# EAGLE design NEW (EAGLE 9.6.2)
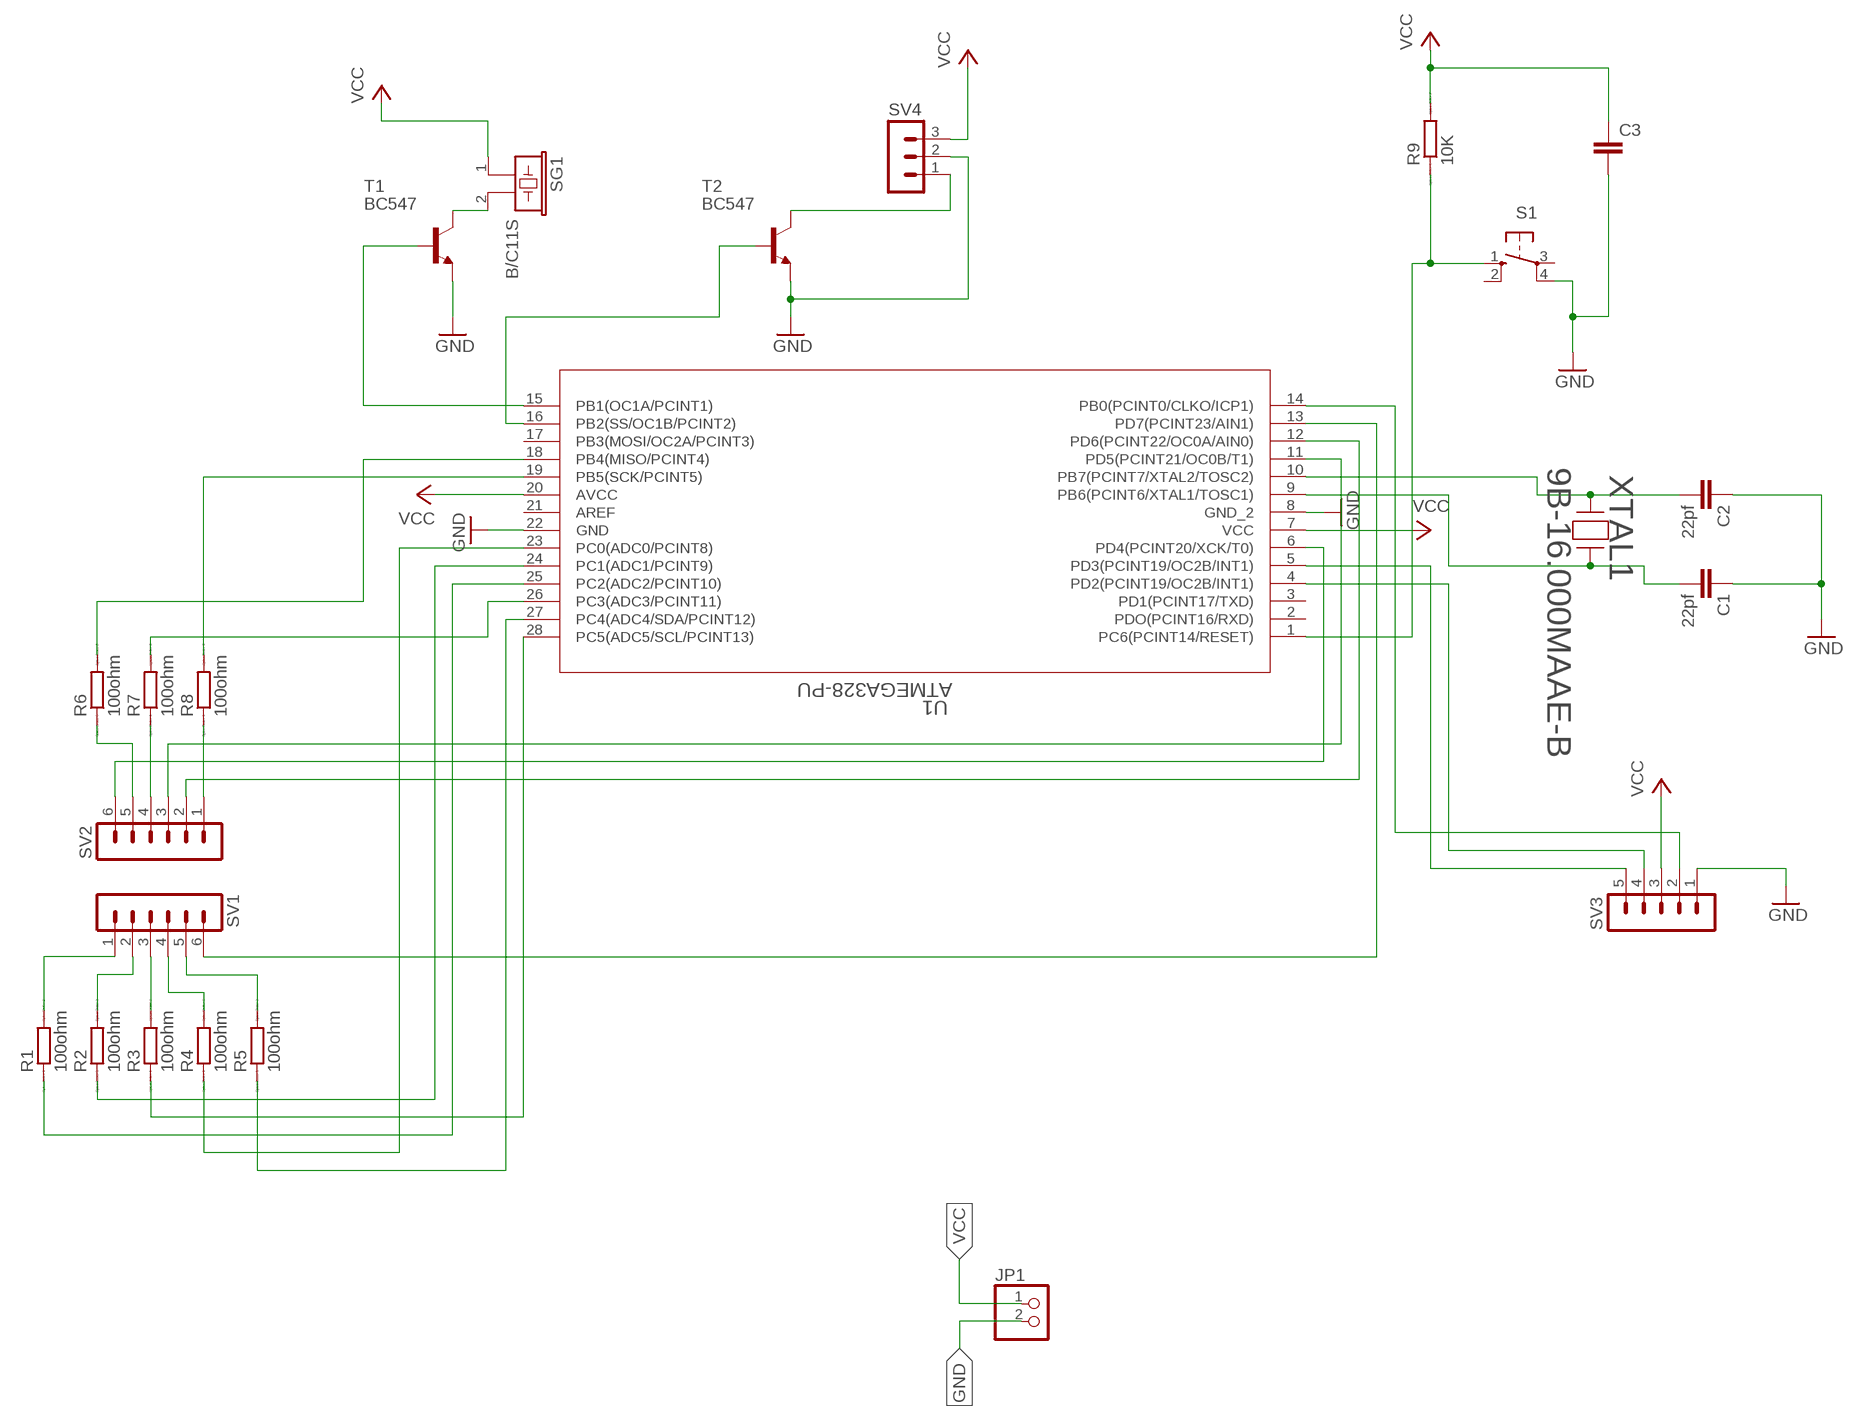
[diagram p0: schematic, sheet 1]

## Parts
C1  22pf  C2,5-3  [C2.5-3]
C2  22pf  C2,5-3  [C2.5-3]
C3  C5/3  [C5B3]
JP1  PINHD-1X2  [1X02]
R1  100ohm  R0204/7  [0204/7]
R2  100ohm  R0204/7  [0204/7]
R3  100ohm  R0204/7  [0204/7]
R4  100ohm  R0204/7  [0204/7]
R5  100ohm  R0204/7  [0204/7]
R6  100ohm  R0204/7  [0204/7]
R7  100ohm  R0204/7  [0204/7]
R8  100ohm  R0204/7  [0204/7]
R9  10K  R0204/7  [0204/7]
S1  10-XX  [B3F-10XX]
SG1  B/C11S  [B/C11S]
SV1  MA06-1  [MA06-1]
SV2  MA06-1  [MA06-1]
SV3  MA05-1  [MA05-1]
SV4  MA03-1  [MA03-1]
T1  BC547  [TO92]
T2  BC547  [TO92]
U1  ATMEGA328-PU  [28P3_SPDIP28_SP_MCH]
XTAL1  9B-16.000MAAE-B  [9B-16.000MAAE-B_TXC]

## Nets
GND: C1.1 C2.1 C3.2 JP1.2 S1.4(P1) SV3.1 SV4.2 T1.1(E) T2.1(E) U1.8(GND_2) U1.22(GND)
N$1: R1.2 SV1.1
N$2: R1.1 U1.25(PC2(ADC2/PCINT10))
N$3: R2.2 SV1.2
N$4: R3.1 U1.28(PC5(ADC5/SCL/PCINT13))
N$5: R3.2 SV1.3
N$6: R4.2 SV1.4
N$7: R2.1 U1.24(PC1(ADC1/PCINT9))
N$8: SV1.6 U1.13(PD7(PCINT23/AIN1))
N$9: R4.1 U1.23(PC0(ADC0/PCINT8))
N$10: R5.2 SV1.5
N$11: R5.1 U1.27(PC4(ADC4/SDA/PCINT12))
N$12: R8.1 SV2.1
N$13: R8.2 U1.19(PB5(SCK/PCINT5))
N$14: SV2.2 U1.12(PD6(PCINT22/OC0A/AIN0))
N$15: SV2.3 U1.11(PD5(PCINT21/OC0B/T1))
N$16: R7.1 SV2.4
N$17: R7.2 U1.26(PC3(ADC3/PCINT11))
N$18: R6.1 SV2.5
N$19: R6.2 U1.18(PB4(MISO/PCINT4))
N$20: SV2.6 U1.6(PD4(PCINT20/XCK/T0))
N$21: C1.2 U1.9(PB6(PCINT6/XTAL1/TOSC1)) XTAL1.2
N$22: C2.2 U1.10(PB7(PCINT7/XTAL2/TOSC2)) XTAL1.1
N$23: T1.2(B) U1.15(PB1(OC1A/PCINT1))
N$24: SV3.2 SV3.5 U1.5(PD3(PCINT19/OC2B/INT1)) U1.14(PB0(PCINT0/CLKO/ICP1))
N$25: SV3.4 U1.4(PD2(PCINT19/OC2B/INT1))
N$26: SG1.2 T1.3(C)
N$27: T2.2(B) U1.16(PB2(SS/OC1B/PCINT2))
N$28: SV4.1 T2.3(C)
N$29: R9.1 S1.1(S) U1.1(PC6(PCINT14/RESET))
VCC: C3.1 JP1.1 R9.2 SG1.1 SV3.3 SV4.3 U1.7(VCC) U1.20(AVCC)
Unconnected: S1.2(S1) S1.3(P) U1.2(PDO(PCINT16/RXD)) U1.3(PD1(PCINT17/TXD)) U1.17(PB3(MOSI/OC2A/PCINT3)) U1.21(AREF)

## Library data of the parts
C1-C3 = capacitor-wima:C: CAPACITOR naming: grid - package width
JP1 = pinhead:PINHD-1X2: PIN HEADER
R1-R9 = eagle-ltspice:R: RESISTOR, European symbol; SPICEMODEL: NONE; SPICEPREFIX: R
S1 = switch-omron:10-XX: OMRON SWITCH; MPN: B3F-1000; OC_FARNELL: 176432; OC_NEWARK: 36M3542
SG1 = buzzer:B/C11S: BUZZER Source: Buerklin; OC_FARNELL: unknown; OC_NEWARK: unknown
SV1 SV2 = con-lstb:MA06-1: PIN HEADER; OC_FARNELL: unknown; OC_NEWARK: unknown
SV3 = con-lstb:MA05-1: PIN HEADER; OC_FARNELL: unknown; OC_NEWARK: unknown
SV4 = con-lstb:MA03-1: PIN HEADER; OC_FARNELL: unknown; OC_NEWARK: unknown
T1 T2 = transistor:BC547: NPN TRANSISTOR
U1 = ATMEGA328PU:ATMEGA328-PU; COPYRIGHT: Copyright (C) 2023 Ultra Librarian. All rights reserved.; MANUFACTURER_PART_NUMBER: ATMEGA328-PU; MFR_NAME: Microchip
XTAL1 = cristaloss16mhz:9B-16.000MAAE-B; COPYRIGHT: Copyright (C) 2023 Ultra Librarian. All rights reserved.; MANUFACTURER_PART_NUMBER: 9B-16.000MAAE-B; MFR_NAME: TXC

## Board
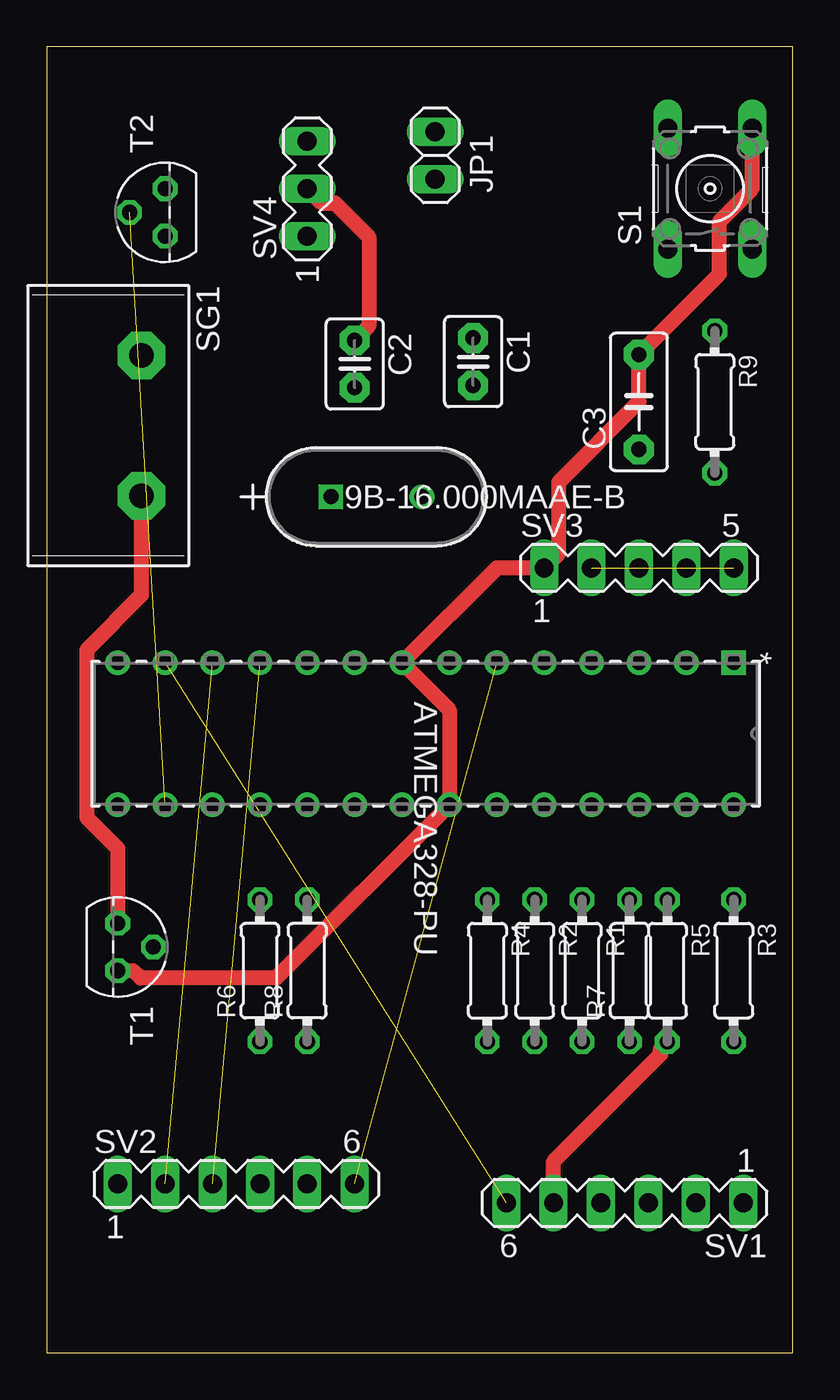
[diagram p1: board, top side]
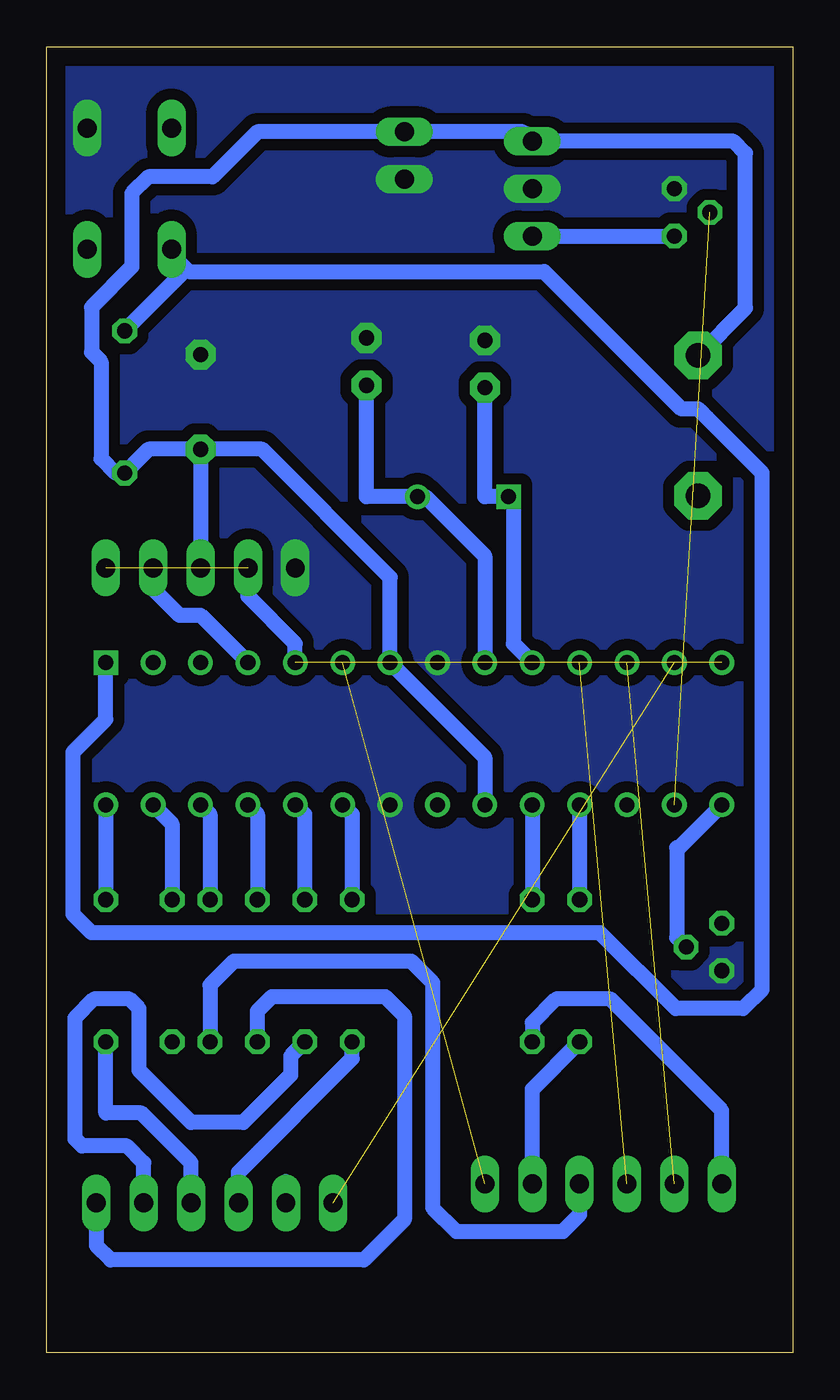
[diagram p2: board, bottom side, seen from below]

Size 40 x 70 mm. Coordinates in mm from the lower left corner, seen from the top.
Outline: 0,0 40,0 40,70 0,70 0,0
Copper layers (1*16): Top 0.035mm / dielectric 1.5mm / Bottom 0.035mm
Design rules "default *": minimum track width 0.8mm, minimum drill 0.08mm, track to track 0.6mm, track to pad 0.6mm, pad to pad 0.6mm, via to via 0.6mm, smd to smd 6mil, copper to edge 40mil, drill to drill 6mil, minimum pad ring 10mil, minimum via ring 8mil, stop-mask expansion 4mil, vias tented up to drill 0mil, thermal gap 10mil

### Footprints (pad centres in the part's own frame; a part is rotated, then mirrored left to right if it is on the bottom)
C2.5-3 = drill 0.813 pad 1.6 octagon: 1 -1.27,0; 2 1.27,0
C5B3 = drill 0.813 pad 1.6 octagon: 1 -2.54,0; 2 2.54,0
1X02 = drill 1.016 long: 1 -1.27,0; 2 1.27,0
0204/7 = drill 0.813 octagon: 1 -3.81,0; 2 3.81,0
B3F-10XX = drill 1.016 long: 1 -3.251,2.261; 2 3.251,2.261; 3 -3.251,-2.261; 4 3.251,-2.261
B/C11S = drill 1.321 pad 2.54 octagon: 1 -3.759,0; 2 3.759,0
MA06-1 = drill 1.016 long: 1 -6.35,0; 2 -3.81,0; 3 -1.27,0; 4 1.27,0; 5 3.81,0; 6 6.35,0
MA05-1 = drill 1.016 long: 1 -5.08,0; 2 -2.54,0; 3 0,0; 4 2.54,0; 5 5.08,0
MA03-1 = drill 1.016 long: 1 -2.54,0; 2 0,0; 3 2.54,0
TO92 = drill 0.813 octagon: 1 1.27,0; 2 0,1.905; 3 -1.27,0
28P3_SPDIP28_SP_MCH = drill 0.813 pad 1.321 square: 1 0,0 | drill 0.813 pad 1.321: 2 0,-2.54; 3 0,-5.08; 4 0,-7.62; 5 0,-10.16; 6 0,-12.7; 7 0,-15.24; 8 0,-17.78; 9 0,-20.32; 10 0,-22.86; 11 0,-25.4; 12 0,-27.94; 13 0,-30.48; 14 0,-33.02; 15 7.62,-33.02; 16 7.62,-30.48; 17 7.62,-27.94; 18 7.62,-25.4; 19 7.62,-22.86; 20 7.62,-20.32; 21 7.62,-17.78; 22 7.62,-15.24; 23 7.62,-12.7; 24 7.62,-10.16; 25 7.62,-7.62; 26 7.62,-5.08; 27 7.62,-2.54; 28 7.62,0
9B-16.000MAAE-B_TXC = drill 0.813 pad 1.321 square: 1 0,0 | drill 0.813 pad 1.321: 2 4.877,0

### Placement (x,y rotation side)
C1  22.86,53.12 270 top
C2  16.51,52.99 270 top
C3  31.75,50.96 90 top
JP1  20.83,64.17 270 top
R1  28.7,20.48 270 top
R2  26.16,20.48 270 top
R3  36.83,20.48 270 top
R4  23.62,20.48 270 top
R5  33.27,20.48 270 top
R6  11.43,20.48 90 top
R7  31.24,20.48 90 top
R8  13.97,20.48 90 top
R9  35.81,50.96 270 top
S1  35.56,62.39 90 top
SG1  5.08,49.69 270 top
SV1  30.99,8.03 180 top
SV2  10.16,9.05 0 top
SV3  31.75,42.07 0 top
SV4  13.97,62.39 90 top
T1  3.81,21.75 270 top
T2  6.35,61.12 90 top
U1  36.83,36.99 270 top
XTAL1  15.24,45.88 0 top

### Tracks (layer width: path | path; a pad name or v marks a point on that pad's centre or on a via)
GND
  Top 0.8: T1.1 4.64,20.48 5.03,20.09 12.31,20.09 U1.22 21.59,34.45 U1.8 24.13,42.07 SV3.1 27.45,42.85 27.45,46.66 31.75,50.97 C3.2 36.06,57.81 36.06,60.63 37.82,62.39 S1.4 | SV4.2 14.75,61.61 15.46,61.61 17.27,59.8 17.27,55.02 C2.1
  pour Bottom (no thermals): 0.51,0.16 39.62,0.16 39.62,69.76 0,69.76 0.51,69.25
N$1
  Bottom 0.8: SV1.1 37.34,5.75 36.58,4.99 22.99,4.99 20.83,7.14 20.83,18.07 21.84,19.08 27.94,19.08 28.7,18.32 R1.2
N$2
  Bottom 0.8: U1.25 28.7,28.86 R1.1
N$3
  Bottom 0.8: SV1.2 34.8,10.19 35.69,11.08 38.1,11.08 38.48,11.46 38.48,17.94 37.47,18.96 35.56,18.96 35.05,18.45 35.05,15.15 32.26,12.35 29.46,12.35 26.92,14.89 26.92,15.91 R2.2
N$4
  Bottom 0.8: U1.28 R3.1
N$5
  Bottom 0.8: R3.2 36.83,12.86 34.92,12.86 32.26,10.19 SV1.3
N$6
  Bottom 0.8: R4.2 23.62,15.78 29.72,9.68 SV1.4
N$7
  Bottom 0.8: U1.24 26.16,28.86 R2.1
N$8  (1 unrouted)
N$9
  Bottom 0.8: U1.23 23.62,28.86 R4.1
N$10
  Top 0.8: R5.2 32.9,16.3 32.9,15.98 27.18,10.26 SV1.5
  Bottom 0.8: SV1.5 27.18,9.18
N$11
  Bottom 0.8: U1.27 33.27,28.35 R5.1
N$12
  Bottom 0.8: R8.1 13.97,17.69 12.7,18.96 9.78,18.96 3.81,12.99 SV2.1
N$13
  Bottom 0.8: U1.19 R8.2
N$14  (1 unrouted)
N$15  (1 unrouted)
N$16
  Bottom 0.8: SV2.4 11.43,7.4 12.32,6.51 18.03,6.51 19.3,7.78 19.3,19.84 20.45,20.99 29.97,20.99 31.24,19.72 R7.1
N$17
  Bottom 0.8: U1.26 31.24,28.86 R7.2
N$18
  Bottom 0.8: R6.1 13.97,14.13 SV2.5
N$19
  Bottom 0.8: U1.18 R6.2
N$20  (1 unrouted)
N$21
  Bottom 0.8: U1.9 16.51,42.7 19.68,45.88 XTAL1.2 22.86,45.88 C1.2
N$22
  Bottom 0.8: U1.10 14.99,38.01 14.99,45.88 XTAL1.1 16.51,45.88 C2.2
N$23
  Bottom 0.8: T1.2 6.22,22.26 6.22,27.08 6.1,27.08 U1.15
N$24  (2 unrouted)
  Bottom 0.8: SV3.2 29.21,40.55 26.67,38.01 U1.5
N$25
  Bottom 0.8: U1.4 31.75,39.53 32.89,39.53 34.29,40.93 SV3.4
N$26
  Top 0.8: SG1.2 5.08,40.61 2.15,37.68 2.15,28.68 3.81,27.02 T1.3
N$27  (1 unrouted)
N$28
  Bottom 0.8: SV4.1 T2.3
N$29
  Bottom 0.8: 32.51,58.07 33.02,58.58 S1.1 | 32.51,58.07 32.38,57.94 13.34,57.94 5.97,50.58 5.08,50.58 1.65,47.15 1.65,19.46 2.67,18.45 6.28,18.45 10.34,22.51 37.59,22.51 38.58,23.5 38.58,32.19 36.83,33.94 U1.1 | 32.51,58.07 R9.1
VCC
  Bottom 0.8: U1.20 16.51,31.91 U1.7 21.59,41.56 28.45,48.42 C3.1 | C3.1 34.54,48.42 R9.2 36.32,47.15 37.08,47.91 37.08,53.12 37.59,53.63 37.59,56.04 35.43,58.2 35.43,62.14 34.54,63.03 31.11,63.03 28.7,65.44 JP1.1 14.48,65.44 SV4.3 | C3.1 SV3.3 | SV4.3 14.35,65.31 | SG1.1 2.54,55.99 2.54,64.3 3.17,64.93 SV4.3